# Altium schematic sheet RS485.SchDoc
size A4
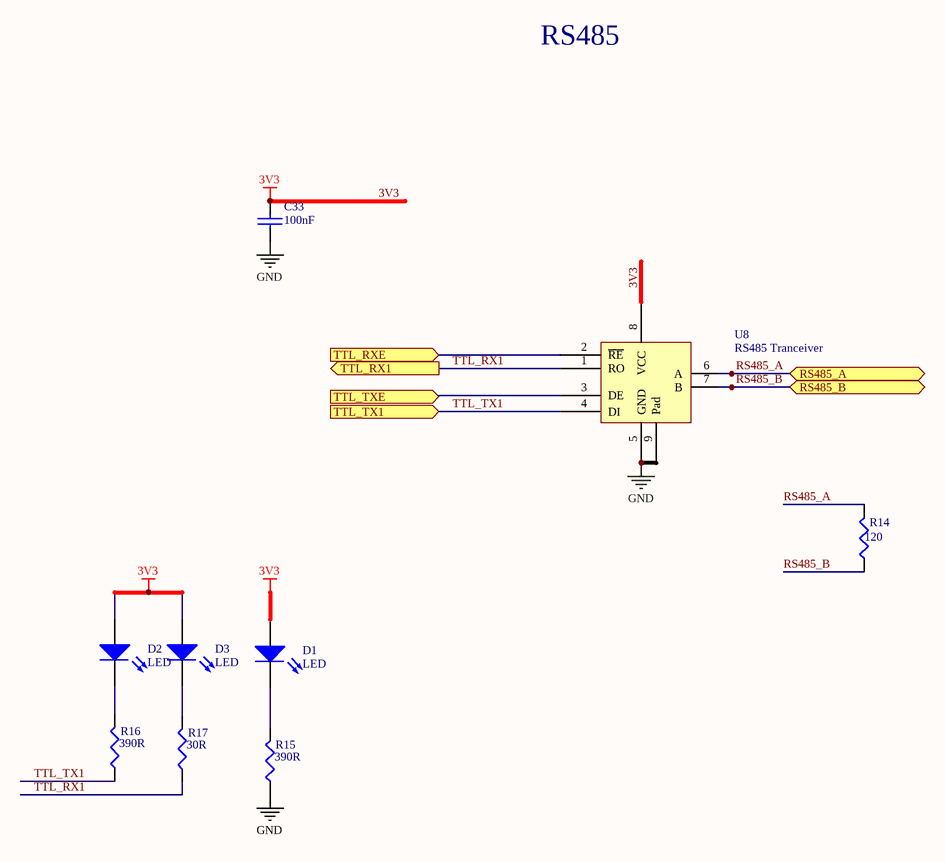
[diagram p0: RS485.SchDoc]

## Parts
C33  value 100nF  [CAP0402]  (hidden comment: Capacitor)
D1  LED  [LED-0603-RED]
D2  LED  [LED-0603-YELLOW]
D3  LED  [LED-0603-GREEN]
R14  value 120  [RES1206]  (hidden comment: Res)
R15  value 390R  [RES0402]  (hidden comment: Res)
R16  value 390R  [RES0402]  (hidden comment: Res)
R17  value 30R  [RES0402]  (hidden comment: Res)
U8  RS485 Tranceiver  [MAX22501EATA+]

## Ports
RS485_A (bidir), RS485_B (bidir), TTL_RX1 (out), TTL_RXE (in), TTL_TX1 (in), TTL_TXE (in)

## Nets
3V3: C33.1 D1.2 D2.2 D3.2 U8.8(VCC)
GND: C33.2 R15.1 U8.5(GND) U8.9(Pad)
RS485_A: R14.2 U8.6(A) ; port RS485_A
RS485_B: R14.1 U8.7(B) ; port RS485_B
TTL_RX1: R17.1 U8.1(RO) ; port TTL_RX1
TTL_RXE: U8.2(~{RE}) ; port TTL_RXE
TTL_TX1: R16.1 U8.4(DI) ; port TTL_TX1
TTL_TXE: U8.3(DE) ; port TTL_TXE
NetD1_1: D1.1 R15.2
NetD2_1: D2.1 R16.2
NetD3_1: D3.1 R17.2

## Notes on the sheet
- RS485

## Library data of the parts
C33 = Capacitor: Manufacturer: TDK Corporation; Manufacturer Part Number: CGA2B3X7R1V104K050BB; Tolerance: 10%; Voltage: 35V; Temperature Coefficient: X7R; Supplier: Digi-Key; Supplier Part Number: 445-6901-1-ND; Footprint: 0402 (1005 Metric); Component Type: Capacitor Ceramic; Price: 0.21
D1 = LED: Manufacturer: Wurth Electronics Inc.; Manufacturer Part Number: 150060RS75000; Colour: Red; Component Type: Red 625nm LED Indication - Discrete 2V 0603 (1608 Metric); Price: 0.39; Supplier: Digi-Key; Supplier Part Number: 732-4978-1-ND
D2 = LED: Manufacturer: Wurth Electronics Inc.; Manufacturer Part Number: 150060YS75000; Colour: Yellow; Component Type: Yellow 590nm LED Indication - Discrete 2V 0603 (1608 Metric); Price: 0.39; Supplier: Digi-Key; Supplier Part Number: 732-4981-1-ND
D3 = LED: Manufacturer: Wurth Electronics Inc.; Manufacturer Part Number: 150060GS75000; Colour: Green; Component Type: Green 520nm LED Indication - Discrete 3.2V 0603 (1608 Metric); Price: 0.39; Supplier: Digi-Key; Supplier Part Number: 732-4971-1-ND
R14 = Resistor: Component Type: Resistor
R15 R16 = Resistor: Manufacturer: Yageo; Manufacturer Part Number: RC0402FR-07390RL; Power Rating: 0.063W; Tolerance: 1%; Component Type: Resistor; Price: 0.14; Supplier: Digi-Key; Supplier Part Number: 311-390LRCT-ND; Footprint: 0201 (0603 Metric)
R17 = Resistor: Manufacturer: Yageo; Manufacturer Part Number: RC0402FR-0730RL; Power Rating: 0.063W; Tolerance: 1%; Component Type: Resistor; Price: 0.14; Supplier: Digi-Key; Supplier Part Number: 311-30LRCT-ND; Footprint: 0201 (0603 Metric)
U8 = MAX22501EATA+: Manufacturer: Maxim Integrated; Price: 2.91; Supplier Part Number: MAX22501EATA+-ND; Manufacturer Part Number: MAX22501EATA+; Component Type: 1/1 Transceiver Half RS422, RS485 8-TDFN (3x3); Supplier: Digi-Key